# Altium schematic sheet Power_In_Protection.SchDoc
size A3; SheetNumber: 2; SheetTotal: 21
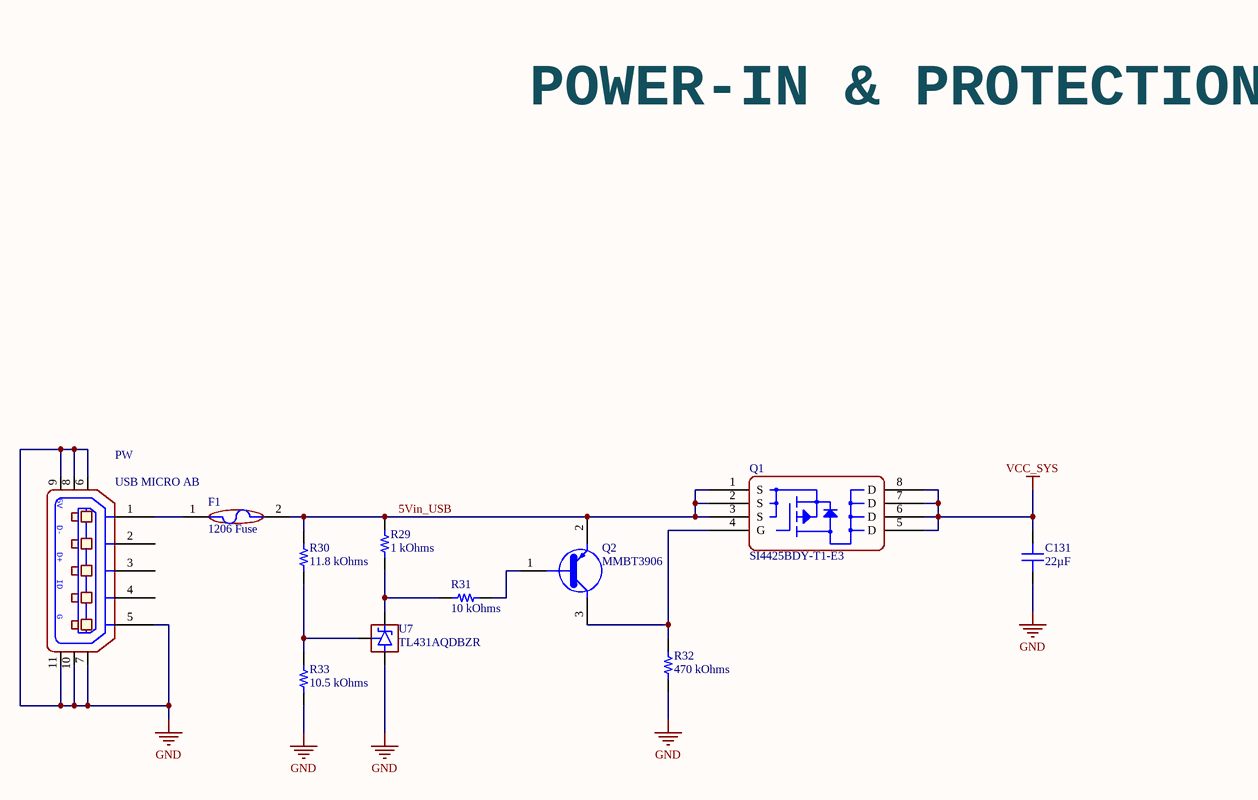
[diagram p0: Power_In_Protection.SchDoc]

## Parts
C131  22µF  [CAP 0603_1608]
F1  1206 Fuse  [FUSE_1206_3216_0.6MM]
PW  USB MICRO AB  [USB_MICRO_AB]
Q1  SI4425BDY-T1-E3  [SO-8]
Q2  MMBT3906  [SOT23_3_95P240X10-3N]
R29  1 kOhms  [RES 1206_3216]
R30  11.8 kOhms  [RES 0402_1005]
R31  10 kOhms  [RES 0402_1005]
R32  470 kOhms  [RES 0402_1005]
R33  10.5 kOhms  [RES 0402_1005]
U7  TL431AQDBZR  [SOT23-3]

## Nets
GND: C131.1 PW.5(P5) PW.6 PW.7 PW.8 PW.9 PW.10 PW.11 R32.1 R33.1 U7.3(ANODE)
VCC_SYS: C131.2 Q1.5(D) Q1.6(D) Q1.7(D) Q1.8(D)
5Vin_USB: F1.2 Q1.1(S) Q1.2(S) Q1.3(S) Q2.2 R29.2 R30.2
NetF1_1: F1.1 PW.1(P1)
NetQ1_4: Q1.4(G) Q2.3 R32.2
NetQ2_1: Q2.1 R31.2
NetR29_1: R29.1 R31.1 U7.1(CATHODE)
NetR30_1: R30.1 R33.2 U7.2(REF)

Not connected (* = marked no-connect by the designer): PW 2(P2) 3(P3) 4(P4)

## Notes on the sheet
- POWER-IN & PROTECTION
- (in symbol 0475890001) 5V; D-; D+; ID; G

## Library data of the parts
C131 = LMK107BBJ226MA-T: CAP CER 22UF 10V X5R 0603; Manufacturer: Taiyo Yuden; Tolerance: ±20%; Part Number: LMK107BBJ226MA-T; Value: 22µF; Applications: SMPS Filtering; Capacitance: 22µF; ComponentLink1Description: Datasheet; ComponentLink1URL: https://ds.yuden.co.jp/TYCOMPAS/ut/detail?pn=LMK107BBJ226MA-T &u=M; ComponentLink2Description: DigiKey Link; ComponentLink2URL: http://digikey.com/product-detail/en/taiyo-yuden/LMK107BBJ226MA-T/587-4913-1-ND/6563756; Device Package: 0603 (1608 Metric); LastUpdated: 9/2/2020 1:03:35 AM; Lifecycle Status: Active; Minimum Order: 1; Mounting Type: Surface Mount, MLCC; Operating Temperature: -55°C ~ 85°C; Package / Case: 0603 (1608 Metric); Packaging: TapeAndReel; PartId: 2677; Part Status: Active; Price: 0.11; Series: M; Size / Dimension: 0.063" L x 0.031" W (1.60mm x 0.80mm); Supplier 1: DigiKey; Supplier Part Number 1: 587-4913-1-ND; Temperature Coefficient: X5R; Thickness (Max): 0.039" (1.00mm); Voltage - Rated: 10V
F1 = Mounted_Fuse: FUSE BRD MNT 4A 32VAC 63VDC 1206; Mfr_Part_No: 3413.0222.22; Mfr: Schurter Inc.
PW = 0475890001: CONN RCPT MICRO USB AB R/A SMD; Mfr: Molex Inc; Connector Type: USB - micro AB; Number of Contacts: 5; Gender: Receptacle; Supplier 1: Digi-Key; Mfr_Part_No: 0475890001; RoHS: RoHS Compliant; Category: Connectors, Interconnects; Stock 1: 12754; Pricing 1: 1=0.81, 10=0.764, 25=0.6872, 50=0.6108, 100=0.5854, 250=0.53452, 500=0.50908 (USD); Packaging: Cut Tape (CT); Specifications: -; Mounting Type: Surface Mount, Right Angle, Horizontal; Features: Board Guide, Shielded; Ingress Protection: -; ComponentLink1URL: http://www.molex.com/pdm_docs/sd/475890001_sd.pdf; ComponentLink1Description: http://www.molex.com/pdm_docs/sd/475890001_sd.pdf; Supplier Part Number 1: WM17143CT-ND
Q1 = SI4425BDY-T1-E3: MOSFET P-CH 30V 8.8A 8-SOIC; Mfr: Vishay Siliconix; FET Type: MOSFET P-Channel, Metal Oxide; FET Feature: Logic Level Gate; Current - Continuous Drain (Id) @ 25°C: 8.8A (Ta); Rds On (Max) @ Id, Vgs: 12 mOhm @ 11.4A, 10V; Vgs(th) (Max) @ Id: 3V @ 250µA; Gate Charge (Qg) @ Vgs: 100nC @ 10V; Power - Max: 1.5W; .Checked PCB: MM; Supplier 1: Digi-Key; Mfr_Part_No: SI4425BDY-T1-E3; RoHS: RoHS Compliant; Category: Discrete Semiconductor Products; Stock 1: 26582; Pricing 1: 1=1, 10=0.88, 25=0.7948, 100=0.6955, 250=0.60996, 500=0.54096, 1000=0.4278 (USD); Packaging: Cut Tape (CT); Drain to Source Voltage (Vdss): 30V; Input Capacitance (Ciss) @ Vds: -; Mounting Type: Surface Mount; Package / Case: 8-SOIC (0.154", 3.90mm Width); Supplier Device Package: 8-SO; ComponentLink1URL: http://www.vishay.com/docs/72000/72000.pdf; ComponentLink1Description: http://www.vishay.com/docs/72000/72000.pdf; Supplier Part Number 1: SI4425BDY-T1-E3CT-ND; .Checked SCH: MM; .Creator: MM
Q2 = MMBT3906: Bipolar (BJT) Transistor PNP 40V 200mA 250MHz 250mW Surface Mount TO-236AB; Mfr_Part_No: MMBT3906,215; Mfr: Nexperia USA; DigiKey_Part_Number: 1727-4045-1-ND; Package: SOT23-3 Nexperia USA Inc.; Value: *
R29 = RNCP1206FTD1K00: RES 1K OHM 1% 1/2W 1206; Manufacturer: Stackpole Electronics Inc; Power (Watts): 0.5W, 1/2W; Temperature Coefficient: ±100ppm/°C; Part Number: RNCP1206FTD1K00; ComponentLink1Description: Datasheet; ComponentLink1URL: https://www.seielect.com/catalog/sei-rncp.pdf; ComponentLink2Description: DigiKey Link; ComponentLink2URL: https://www.digikey.com/en/products/detail/stackpole-electronics-inc/RNCP1206FTD1K00/2240337; Composition: Thin Film; Device Package: 1206 (3216 Metric); Features: Anti-Sulfur, Moisture Resistant; Height - Seated (Max): 0.024" (0.60mm); LastUpdated: 2/26/2022 8:52:38 AM; Lifecycle Status: Active; Minimum Order: 1; Number of Terminations: 2; Operating Temperature: -55°C ~ 155°C; Package / Case: 1206 (3216 Metric); Packaging: TapeAndReel; PartId: 26970; Part Status: Active; Price: 0.01; Resistance: 1 kOhms; Series: RNCP; Size / Dimension: 0.122" L x 0.059" W (3.10mm x 1.50mm); Supplier 1: DigiKey; Supplier Part Number 1: RNCP1206FTD1K00CT-ND; Supplier Device Package: 1206; Tolerance: ±1%; Value: 1 kOhms
R30 = RC0402FR-0711K8L: RES 11.8K OHM 1% 1/16W 0402; Manufacturer: Yageo; Power (Watts): 0.063W, 1/16W; Temperature Coefficient: ±100ppm/°C; Part Number: RC0402FR-0711K8L; Value: 11.8 kOhms; ComponentLink1Description: Datasheet; ComponentLink1URL: https://www.yageo.com/upload/media/product/productsearch/datasheet/rchip/PYu-RC_Group_51_RoHS_L_10.pdf; ComponentLink2Description: DigiKey Link; ComponentLink2URL: https://www.digikey.com/en/products/detail/yageo/RC0402FR-0711K8L/5280818; Composition: Thick Film; Device Package: 0402 (1005 Metric); Features: Moisture Resistant; Height - Seated (Max): 0.016" (0.40mm); LastUpdated: 2/26/2022 8:42:17 AM; Lifecycle Status: Active; Minimum Order: 1; Number of Terminations: 2; Operating Temperature: -55°C ~ 155°C; Package / Case: 0402 (1005 Metric); Packaging: CutTape; PartId: 2614; Part Status: Active; Price: 0.01; Resistance: 11.8 kOhms; Series: RC_L; Size / Dimension: 0.039" L x 0.020" W (1.00mm x 0.50mm); Supplier 1: DigiKey; Supplier Part Number 1: YAG2958CT-ND; Supplier Device Package: 0402; Tolerance: ±1%
R31 = RP73PF1E10KBTD: RES 10K OHM 0.1% 1/10W 0402; Manufacturer: TE Connectivity Passive Product; Power (Watts): 0.1W, 1/10W; Temperature Coefficient: ±25ppm/°C; Part Number: RP73PF1E10KBTD; Value: 10 kOhms; ComponentLink1Description: Datasheet; ComponentLink1URL: https://www.te.com/commerce/DocumentDelivery/DDEController?Action=srchrtrv&DocNm=1773272&DocType=DS&DocLang=English; ComponentLink2Description: DigiKey Link; ComponentLink2URL: https://www.digikey.com/en/products/detail/te-connectivity-passive-product/RP73PF1E10KBTD/8260957; Composition: Thin Film; Device Package: 0402 (1005 Metric); Height - Seated (Max): 0.014" (0.35mm); LastUpdated: 2/26/2022 8:42:17 AM; Lifecycle Status: Active; Minimum Order: 1; Number of Terminations: 2; Operating Temperature: -55°C ~ 155°C; Package / Case: 0402 (1005 Metric); Packaging: TapeAndReel; PartId: 2434; Part Status: Active; Price: 0.09; Resistance: 10 kOhms; Series: RP73, Holsworthy; Size / Dimension: 0.039" L x 0.020" W (1.00mm x 0.50mm); Supplier 1: DigiKey; Supplier Part Number 1: A127415CT-ND; Supplier Device Package: 0402; Tolerance: ±0.1%
R32 = CRGP0402F470K: RES 470K OHM 1% 1/8W 0402; Manufacturer: TE Connectivity Passive Product; Power (Watts): 0.125W, 1/8W; Temperature Coefficient: ±100ppm/°C; Part Number: CRGP0402F470K; Value: 470 kOhms; ComponentLink1Description: Datasheet; ComponentLink1URL: https://www.te.com/commerce/DocumentDelivery/DDEController?Action=srchrtrv&DocNm=9-1773463-9&DocType=DS&DocLang=English; ComponentLink2Description: DigiKey Link; ComponentLink2URL: https://www.digikey.com/en/products/detail/te-connectivity-passive-product/CRGP0402F470K/8576989; Composition: Thick Film; Device Package: 0402 (1005 Metric); Features: Pulse Withstanding; Height - Seated (Max): 0.016" (0.40mm); LastUpdated: 2/26/2022 8:42:16 AM; Lifecycle Status: Active; Minimum Order: 1; Number of Terminations: 2; Operating Temperature: -55°C ~ 155°C; Package / Case: 0402 (1005 Metric); Packaging: TapeAndReel; PartId: 2840; Part Status: Active; Price: 0.01; Resistance: 470 kOhms; Series: CRGP; Size / Dimension: 0.043" L x 0.020" W (1.10mm x 0.50mm); Supplier 1: DigiKey; Supplier Part Number 1: A130387CT-ND; Supplier Device Package: 0402; Tolerance: ±1%
R33 = RC0402FR-0710K5L: RES 10.5K OHM 1% 1/16W 0402; Manufacturer: Yageo; Power (Watts): 0.063W, 1/16W; Temperature Coefficient: ±100ppm/°C; Part Number: RC0402FR-0710K5L; Value: 10.5 kOhms; ComponentLink1Description: Datasheet; ComponentLink1URL: https://www.yageo.com/upload/media/product/productsearch/datasheet/rchip/PYu-RC_Group_51_RoHS_L_10.pdf; ComponentLink2Description: DigiKey Link; ComponentLink2URL: https://www.digikey.com/en/products/detail/yageo/RC0402FR-0710K5L/5280811; Composition: Thick Film; Device Package: 0402 (1005 Metric); Features: Moisture Resistant; Height - Seated (Max): 0.016" (0.40mm); LastUpdated: 2/26/2022 8:42:16 AM; Lifecycle Status: Active; Minimum Order: 1; Number of Terminations: 2; Operating Temperature: -55°C ~ 155°C; Package / Case: 0402 (1005 Metric); Packaging: CutTape; PartId: 2734; Part Status: Active; Price: 0.01; Resistance: 10.5 kOhms; Series: RC_L; Size / Dimension: 0.039" L x 0.020" W (1.00mm x 0.50mm); Supplier 1: DigiKey; Supplier Part Number 1: YAG2951CT-ND; Supplier Device Package: 0402; Tolerance: ±1%
U7 = TL431AQDBZR: Shunt Voltage Reference IC 36V ±1% SOT-23-3; Mfr: Texas Instruments; Package: SOT-23-3 Texas Instruments; Mfr_Part_No: TL431AQDBZR; Value: *; Availability: Unavailable; Price: None; Mouser No: 595-TL431AQDBZR